# Altium schematic sheet S3 base.SchDoc
size A4; Organization: Blinkinlabs, LLC; DocumentNumber: 4; SheetNumber: 4; SheetTotal: 4
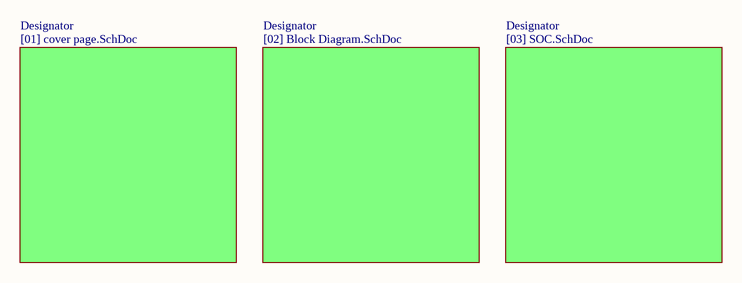
[diagram p0: S3 base.SchDoc]

## Sub-sheets
Designator = [01] cover page.SchDoc: no entries
Designator = [02] Block Diagram.SchDoc: no entries
Designator = [03] SOC.SchDoc: no entries

## Notes on the sheet
- Title:
- Project:
- Revision:
- Date:
- Time:
- Sheet
- of